# Altium project ife18_TS_BMS_LTC6811_v1.PrjPcb
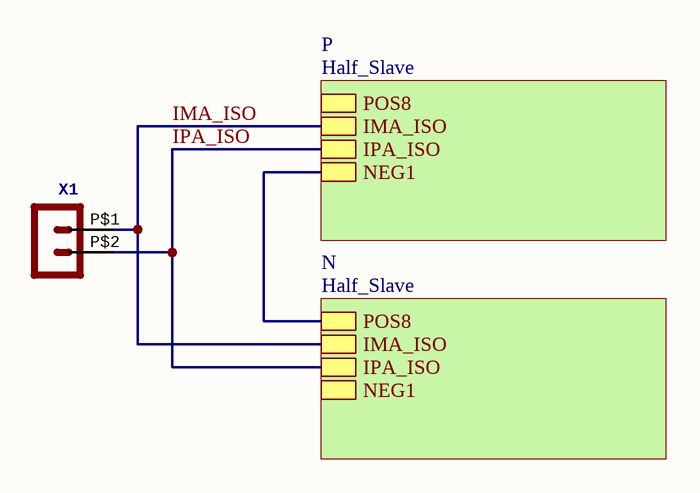
[diagram p0: Slave.SchDoc]
4 sheets, 247 parts. Net scope: hierarchical (ports join the sheet entries above them; power ports are global).
Board file: Slave.PcbDoc
Sheets:
  Slave.SchDoc
    P = Half_Slave.SchDoc
      C = Cells.SchDoc
        1 = Cell.SchDoc
        2 = Cell.SchDoc
        3 = Cell.SchDoc
        4 = Cell.SchDoc
        5 = Cell.SchDoc
        6 = Cell.SchDoc
        7 = Cell.SchDoc
        8 = Cell.SchDoc
    N = Half_Slave.SchDoc
      C = Cells.SchDoc
        1 = Cell.SchDoc
        2 = Cell.SchDoc
        3 = Cell.SchDoc
        4 = Cell.SchDoc
        5 = Cell.SchDoc
        6 = Cell.SchDoc
        7 = Cell.SchDoc
        8 = Cell.SchDoc

## Sheet Slave.SchDoc
size A

### Parts
X1  Molex - Micro-Fit 3.0 Series connector,  3.00mm (0.118") pitch header, 2 positions.  [43650-0224]  (value not drawn)

### Sub-sheets
N = Half_Slave: POS8, IMA_ISO, IPA_ISO, NEG1
P = Half_Slave: POS8, IMA_ISO, IPA_ISO, NEG1

### Nets
IMA_ISO: X1.P$1 ; sheet P/IMA_ISO, sheet N/IMA_ISO
IPA_ISO: X1.P$2 ; sheet P/IPA_ISO, sheet N/IPA_ISO
NEG: sheet P/NEG1, sheet N/POS8

### Library data of the parts
X1 = POS2_MF43650-0224: GateName_1: G$1; SymbolName_1: HEADER_POS2; DeviceSetName: HEADER_POS2_?; DeviceName: 43650-0224; LibraryName: MOLEX Micro-Fit; Package: 43650-0224

## Sheet Half_Slave.SchDoc
size A
Used 2 times, as channels P, N. Parts and nets are listed once, with the designators drawn on the sheet.
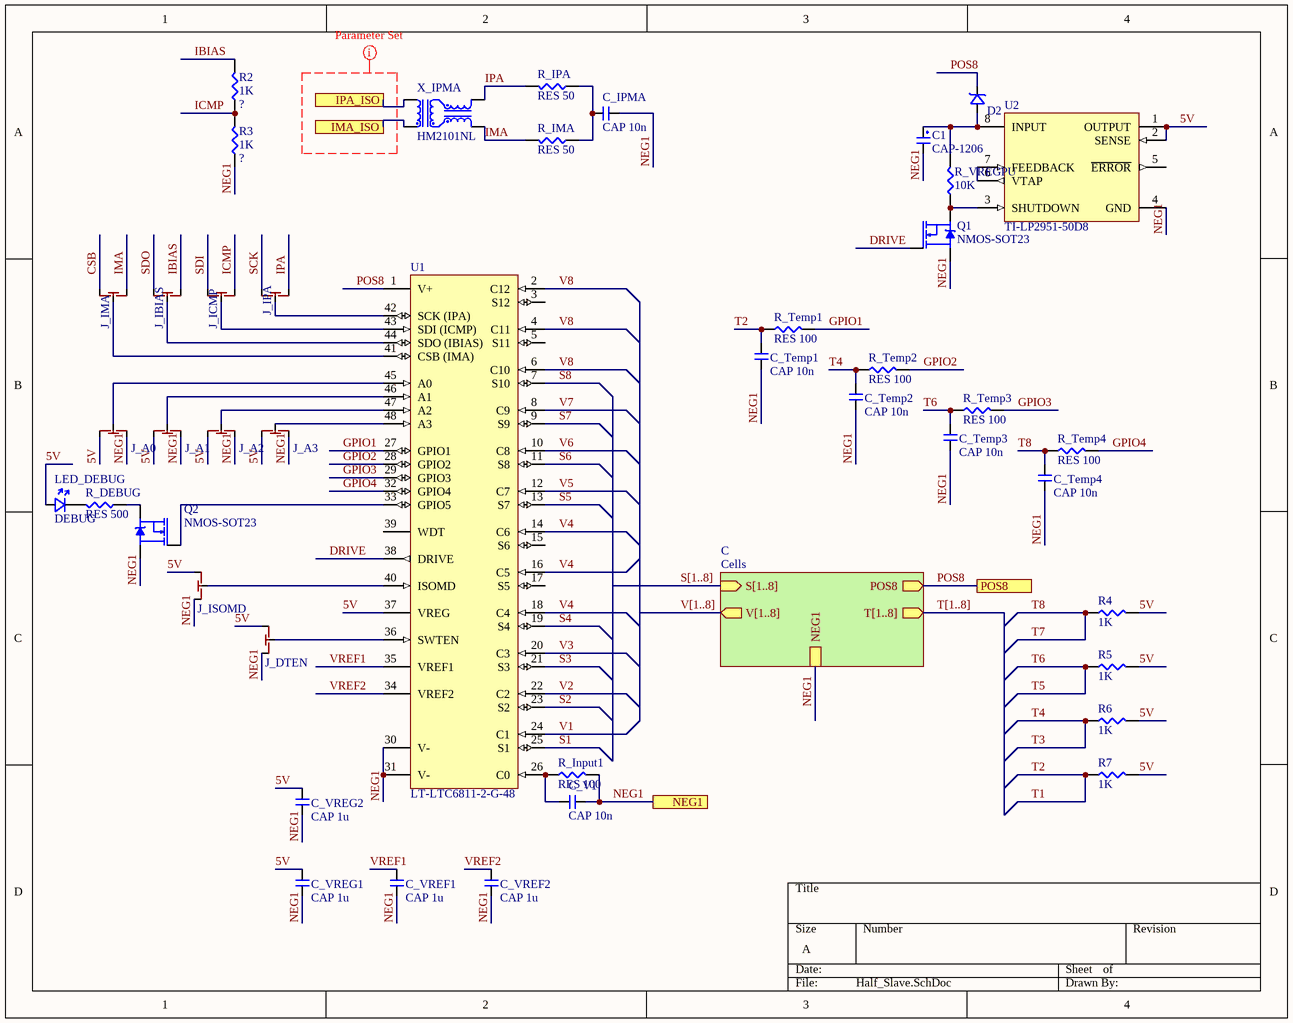
[diagram p1: Half_Slave.SchDoc]

### Parts
C1  CAP-1206  [CAPCP3216X16N]
C_IPMA  CAP 10n  [CAP-0603]
C_Temp1  CAP 10n  [CAP-0603]
C_Temp2  CAP 10n  [CAP-0603]
C_Temp3  CAP 10n  [CAP-0603]
C_Temp4  CAP 10n  [CAP-0603]
C_V1  CAP 10n  [CAP-0603]
C_VREF1  CAP 1u  [CAP-0603]
C_VREF2  CAP 1u  [CAP-0603]
C_VREG1  CAP 1u  [CAP-0603]
C_VREG2  CAP 1u  [CAP-0603]
D2  ?  [SMB]  (value not drawn)
J_A0  DPDT Solder Jumper  [DPDT Solder]  (value not drawn)
J_A1  DPDT Solder Jumper  [DPDT Solder]  (value not drawn)
J_A2  DPDT Solder Jumper  [DPDT Solder]  (value not drawn)
J_A3  DPDT Solder Jumper  [DPDT Solder]  (value not drawn)
J_DTEN  DPDT Solder Jumper  [DPDT Solder]  (value not drawn)
J_IBIAS  DPDT Solder Jumper  [DPDT Solder]  (value not drawn)
J_ICMP  DPDT Solder Jumper  [DPDT Solder]  (value not drawn)
J_IMA  DPDT Solder Jumper  [DPDT Solder]  (value not drawn)
J_IPA  DPDT Solder Jumper  [DPDT Solder]  (value not drawn)
J_ISOMD  DPDT Solder Jumper  [DPDT Solder]  (value not drawn)
LED_DEBUG  DEBUG  [LED-0603]
Q1  NMOS-SOT23  [SOT23]
Q2  NMOS-SOT23  [SOT23]
R2  1K  [RES-0603]
R3  1K  [RES-0603]
R4  1K  [RES-0603]
R5  1K  [RES-0603]
R6  1K  [RES-0603]
R7  1K  [RES-0603]
R_DEBUG  RES 500  [RES-0603]
R_IMA  RES 50  [RES-0603]
R_Input1  RES 100  [RES-0603]
R_IPA  RES 50  [RES-0603]
R_Temp1  RES 100  [RES-0603]
R_Temp2  RES 100  [RES-0603]
R_Temp3  RES 100  [RES-0603]
R_Temp4  RES 100  [RES-0603]
R_VREGPU  10K  [RES-0603]
U1  LT-LTC6811-2-G-48  [SSOP-48N]
U2  TI-LP2951-50D8  [SOIC127P600X175-8N]
X_IPMA  HM2101NL  [HM2101]

### Sub-sheets
C = Cells: S[1..8] (in), POS8 (out), T[1..8] (out), V[1..8] (out), NEG1

### Ports
IMA_ISO, IPA_ISO, NEG1, POS8

### Nets
5V: C_VREG1.2 C_VREG2.2 J_A0.2 J_A1.2 J_A2.2 J_A3.2 J_DTEN.2 J_ISOMD.2 LED_DEBUG.A R4.2 R5.2 R6.2 R7.2 U1.37(VREG) U2.1(OUTPUT) U2.2(SENSE)
CSB: J_IMA.1
DRIVE: Q1.1(G) U1.38(DRIVE)
GPIO1: R_Temp1.2 U1.27(GPIO1)
GPIO2: R_Temp2.2 U1.28(GPIO2)
GPIO3: R_Temp3.2 U1.29(GPIO3)
GPIO4: R_Temp4.2 U1.32(GPIO4)
IBIAS: J_IBIAS.2 R2.2
ICMP: J_ICMP.2 R2.1 R3.2
IMA: J_IMA.2 R_IMA.2 X_IPMA.4
IMA_ISO: X_IPMA.3 ; port IMA_ISO
IPA: J_IPA.2 R_IPA.2 X_IPMA.6
IPA_ISO: X_IPMA.1 ; port IPA_ISO
NEG1: C1.2 C_IPMA.1 C_Temp1.1 C_Temp2.1 C_Temp3.1 C_Temp4.1 C_V1.1 C_VREF1.1 C_VREF2.1 C_VREG1.1 C_VREG2.1 J_A0.1 J_A1.1 J_A2.1 J_A3.1 J_DTEN.1 J_ISOMD.1 Q1.2(S) Q2.2(S) R3.1 R_Input1.2 U1.30(V-) U1.31(V-) U2.4(GND) ; port NEG1, sheet C/NEG1
POS8: D2.K U1.1(V+) ; port POS8, sheet C/POS8
S1: U1.25(S1)
S2: U1.23(S2)
S3: U1.21(S3)
S4: U1.19(S4)
S5: U1.13(S7)
S6: U1.11(S8)
S7: U1.9(S9)
S8: U1.7(S10)
SCK: J_IPA.1
SDI: J_ICMP.1
SDO: J_IBIAS.1
T1: C_Temp1.2 R7.1 R_Temp1.1  [also labelled T2]
T3: C_Temp2.2 R6.1 R_Temp2.1  [also labelled T4]
T5: C_Temp3.2 R5.1 R_Temp3.1  [also labelled T6]
T7: C_Temp4.2 R4.1 R_Temp4.1  [also labelled T8]
V1: U1.24(C1)
V2: U1.22(C2)
V3: U1.20(C3)
V4: U1.14(C6) U1.16(C5) U1.18(C4)
V5: U1.12(C7)
V6: U1.10(C8)
V7: U1.8(C9)
V8: U1.2(C12) U1.4(C11) U1.6(C10)
VREF1: C_VREF1.2 U1.35(VREF1)
VREF2: C_VREF2.2 U1.34(VREF2)
NetC1_1: C1.1 D2.A R_VREGPU.2 U2.8(INPUT)
NetC_IPMA_2: C_IPMA.2 R_IMA.1 R_IPA.1
NetC_V1_2: C_V1.2 R_Input1.1 U1.26(C0)
NetJ_A0_3: J_A0.3 U1.45(A0)
NetJ_A1_3: J_A1.3 U1.46(A1)
NetJ_A2_3: J_A2.3 U1.47(A2)
NetJ_A3_3: J_A3.3 U1.48(A3)
NetJ_DTEN_3: J_DTEN.3 U1.36(SWTEN)
NetJ_IBIAS_3: J_IBIAS.3 U1.44(SDO_(IBIAS))
NetJ_ICMP_3: J_ICMP.3 U1.43(SDI_(ICMP))
NetJ_IMA_3: J_IMA.3 U1.41(CSB_(IMA))
NetJ_IPA_3: J_IPA.3 U1.42(SCK_(IPA))
NetJ_ISOMD_3: J_ISOMD.3 U1.40(ISOMD)
NetLED_DEBUG_K: LED_DEBUG.K R_DEBUG.2
NetQ1_3: Q1.3(D) R_VREGPU.1 U2.3(SHUTDOWN)
NetQ2_1: Q2.1(G) U1.33(GPIO5)
NetQ2_3: Q2.3(D) R_DEBUG.1
NetU2_6: U2.6(VTAP) U2.7(FEEDBACK)

Not connected (* = marked no-connect by the designer): U1 3(S12) 5(S11) 15(S6) 17(S5) 39(WDT); U2 5(~{ERROR})

### Channels
P: designators end in _P; ports IMA_ISO=IMA_ISO IPA_ISO=IPA_ISO NEG1=NEG POS8=POS8_P
N: designators end in _N; ports IMA_ISO=IMA_ISO IPA_ISO=IPA_ISO NEG1=NEG POS8=NEG

### Buses and harness runs
bus S[1..8] = sheet C/S[1..8]
bus T[1..8] = sheet C/T[1..8]
bus V[1..8] = sheet C/V[1..8]

### Layout directives
rule Clearance Constraint [Clearance = 32mil]; net class ISO: (no net found under the mark)

### Library data of the parts
C_IPMA C_Temp1-C_Temp4 C_V1 C_VREF1 C_VREF2 C_VREG1 C_VREG2 = CAP-0603
D2 = DIODE-SMB
J_A0-J_A3 J_DTEN J_IBIAS J_ICMP J_IMA J_IPA J_ISOMD = DPDT Solder
LED_DEBUG = LED-0603
R2 R3 = RES_0603: RES SMD 0603; Company: IFE; Part: RES_0603; Value: ?; Package: 0603
R4-R7 R_DEBUG R_IMA R_Input1 R_IPA R_Temp1-R_Temp4 R_VREGPU = RES-0603

## Sheet Cells.SchDoc
size 190 x 114 mm
Used 2 times, as channels P/C, N/C. Parts and nets are listed once, with the designators drawn on the sheet.
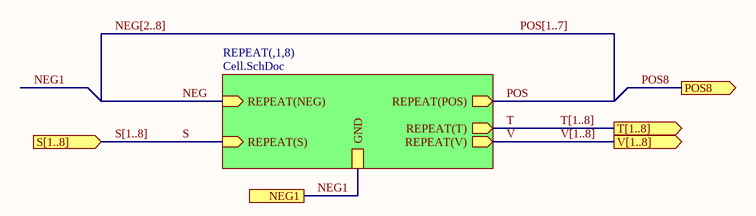
[diagram p2: Cells.SchDoc]

### Sub-sheets
REPEAT(,1,8) = Cell.SchDoc: REPEAT(NEG) (in), REPEAT(POS) (out), REPEAT(T) (out), REPEAT(V) (out), REPEAT(S) (in), GND

### Ports
NEG1, POS8 (out), S[1..8] (in), T[1..8] (out), V[1..8] (out)

### Nets
NEG: sheet REPEAT(,1,8)/REPEAT(NEG)
NEG1: port NEG1, sheet REPEAT(,1,8)/GND
POS: sheet REPEAT(,1,8)/REPEAT(POS)
POS8: port POS8
S: sheet REPEAT(,1,8)/REPEAT(S)
T: sheet REPEAT(,1,8)/REPEAT(T)
V: sheet REPEAT(,1,8)/REPEAT(V)

### Channels
P/C: ports NEG1=NEG POS8=POS8_P
N/C: ports NEG1=NEG POS8=NEG

### Buses and harness runs
bus NEG[2..8] = POS[1..7]
bus S[1..8] = port S[1..8]
bus T[1..8] = port T[1..8]
bus V[1..8] = port V[1..8]

## Sheet Cell.SchDoc
size 152 x 88 mm
Used 16 times, as channels P/C/1, P/C/2, P/C/3, P/C/4, P/C/5, P/C/6, P/C/7, P/C/8, N/C/1, N/C/2, N/C/3, N/C/4, N/C/5, N/C/6, N/C/7, N/C/8. Parts and nets are listed once, with the designators drawn on the sheet.
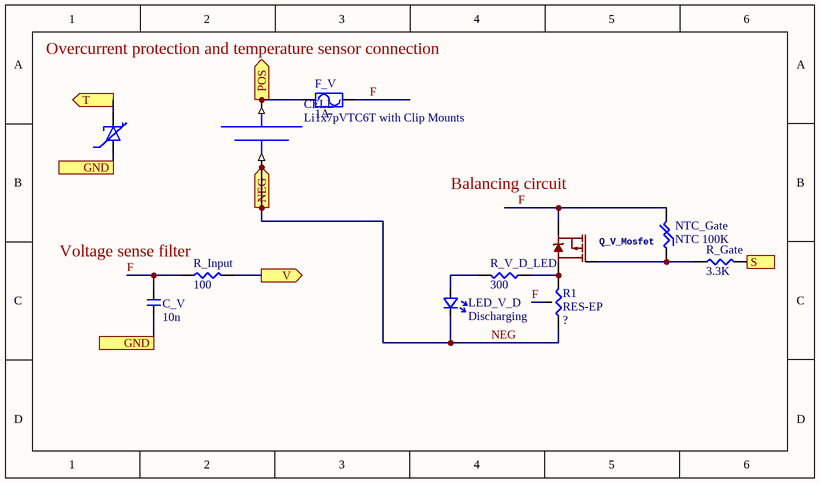
[diagram p3: Cell.SchDoc]

### Parts
C_V  10n  [CAP-0603]
CELL  Li1x7pVTC6T with Clip Mounts  [Li1x7pVTC6T_Clips]
F_V  1A  [2410SMD]
LED_V_D  Discharging  [LED-0603]
NTC_Gate  NTC 100K  [NTC-0603]
Q_V_Mosfet  (no value)  [TO252]
R1  RES-EP  [RES-TO252]
R_Gate  3.3K  [RES-0603]
R_Input  100  [RES-0603]
R_V_D_LED  300  [RES-0603]

### Ports
GND, NEG (in), POS (out), S (in), T (out), V (out)

### Nets
F: C_V.2 F_V.1 NTC_Gate.2 Q_V_Mosfet.3(S) R1.3 R_Input.1
GND: C_V.1 CELL.T- ; port GND
NEG: CELL.- CELL.-L CELL.-O CELL.-R LED_V_D.K R1.1 ; port NEG
POS: CELL.+ CELL.+L CELL.+O CELL.+R F_V.2 ; port POS
S: R_Gate.2 ; port S
T: CELL.T+ ; port T
V: R_Input.2 ; port V
NetLED_V_D_A: LED_V_D.A R_V_D_LED.2
NetNTC_Gate_1: NTC_Gate.1 Q_V_Mosfet.1(G) R_Gate.1
NetQ_V_Mosfet_2: Q_V_Mosfet.2(D) R1.2 R_V_D_LED.1

### Channels
P/C/1: designators end in _CELL9; ports GND=NEG NEG=NEG POS=NEG S=S1_P T=T1_P V=V1_P
P/C/2: designators end in _CELL10; ports GND=NEG NEG=NEG POS=NEG S=S2_P T=T1_P V=V2_P
P/C/3: designators end in _CELL11; ports GND=NEG NEG=NEG POS=NEG S=S3_P T=T3_P V=V3_P
P/C/4: designators end in _CELL12; ports GND=NEG NEG=NEG POS=NEG S=S4_P T=T3_P V=V4_P
P/C/5: designators end in _CELL13; ports GND=NEG NEG=NEG POS=NEG S=S5_P T=T5_P V=V5_P
P/C/6: designators end in _CELL14; ports GND=NEG NEG=NEG POS=NEG S=S6_P T=T5_P V=V6_P
P/C/7: designators end in _CELL15; ports GND=NEG NEG=NEG POS=NEG S=S7_P T=T7_P V=V7_P
P/C/8: designators end in _CELL16; ports GND=NEG NEG=NEG POS=POS8_P S=S8_P T=T7_P V=V8_P
N/C/1: designators end in _CELL1; ports GND=NEG NEG=NEG POS=NEG S=S1_N T=T1_N V=V1_N
N/C/2: designators end in _CELL2; ports GND=NEG NEG=NEG POS=NEG S=S2_N T=T1_N V=V2_N
N/C/3: designators end in _CELL3; ports GND=NEG NEG=NEG POS=NEG S=S3_N T=T3_N V=V3_N
N/C/4: designators end in _CELL4; ports GND=NEG NEG=NEG POS=NEG S=S4_N T=T3_N V=V4_N
N/C/5: designators end in _CELL5; ports GND=NEG NEG=NEG POS=NEG S=S5_N T=T5_N V=V5_N
N/C/6: designators end in _CELL6; ports GND=NEG NEG=NEG POS=NEG S=S6_N T=T5_N V=V6_N
N/C/7: designators end in _CELL7; ports GND=NEG NEG=NEG POS=NEG S=S7_N T=T7_N V=V7_N
N/C/8: designators end in _CELL8; ports GND=NEG NEG=NEG POS=NEG S=S8_N T=T7_N V=V8_N

### Notes on the sheet
- Overcurrent protection and temperature sensor connection
- (near Q_V_Mosfet) Balancing circuit
- (near R_Input) Voltage sense filter

### Library data of the parts
C_V = CAP-0603
CELL = Li1x7pVTC6T_Clip
F_V = 0679L
LED_V_D = LED-0603
NTC_Gate = NTC-0603
Q_V_Mosfet = DMP10H400SK3-13: GateName_1: G$1; SymbolName_1: LABELED-PMOS; LibraryName: IFE_Transistors; DeviceSetName: DMP10H400SK3-13; Package: TO252
R1 = RES_TO252: RES SMD TO252; Company: IFE; Part: RES_TO252; Value: ?; Package: TO252
R_Gate R_Input R_V_D_LED = RES-0603

## Nets that join several sheets
IMA_ISO: Slave (X1.P$1), P (X_IPMA_P.3), N (X_IPMA_N.3)
IPA_ISO: Slave (X1.P$2), P (X_IPMA_P.1), N (X_IPMA_N.1)
NEG: P (24 pins), P/C/1 (8 pins), P/C/2 (C_V_CELL10.1 CELL_CELL10.T-), P/C/3 (C_V_CELL11.1 CELL_CELL11.T-), P/C/4 (C_V_CELL12.1 CELL_CELL12.T-), P/C/5 (C_V_CELL13.1 CELL_CELL13.T-), P/C/6 (C_V_CELL14.1 CELL_CELL14.T-), P/C/7 (C_V_CELL15.1 CELL_CELL15.T-), P/C/8 (C_V_CELL16.1 CELL_CELL16.T-), N (D2_N.K U1_N.1), N/C/8 (5 pins)
NEG: P/C/1 (5 pins), P/C/2 (6 pins)
NEG: P/C/2 (5 pins), P/C/3 (6 pins)
NEG: P/C/3 (5 pins), P/C/4 (6 pins)
NEG: P/C/4 (5 pins), P/C/5 (6 pins)
NEG: P/C/5 (5 pins), P/C/6 (6 pins)
NEG: P/C/6 (5 pins), P/C/7 (6 pins)
NEG: P/C/7 (5 pins), P/C/8 (6 pins)
NEG: N (24 pins), N/C/1 (8 pins), N/C/2 (C_V_CELL2.1 CELL_CELL2.T-), N/C/3 (C_V_CELL3.1 CELL_CELL3.T-), N/C/4 (C_V_CELL4.1 CELL_CELL4.T-), N/C/5 (C_V_CELL5.1 CELL_CELL5.T-), N/C/6 (C_V_CELL6.1 CELL_CELL6.T-), N/C/7 (C_V_CELL7.1 CELL_CELL7.T-), N/C/8 (C_V_CELL8.1 CELL_CELL8.T-)
NEG: N/C/1 (5 pins), N/C/2 (6 pins)
NEG: N/C/2 (5 pins), N/C/3 (6 pins)
NEG: N/C/3 (5 pins), N/C/4 (6 pins)
NEG: N/C/4 (5 pins), N/C/5 (6 pins)
NEG: N/C/5 (5 pins), N/C/6 (6 pins)
NEG: N/C/6 (5 pins), N/C/7 (6 pins)
NEG: N/C/7 (5 pins), N/C/8 (6 pins)
POS8_P: P (D2_P.K U1_P.1), P/C/8 (5 pins)
S1_N: N (U1_N.25), N/C/1 (R_Gate_CELL1.2)
S1_P: P (U1_P.25), P/C/1 (R_Gate_CELL9.2)
S2_N: N (U1_N.23), N/C/2 (R_Gate_CELL2.2)
S2_P: P (U1_P.23), P/C/2 (R_Gate_CELL10.2)
S3_N: N (U1_N.21), N/C/3 (R_Gate_CELL3.2)
S3_P: P (U1_P.21), P/C/3 (R_Gate_CELL11.2)
S4_N: N (U1_N.19), N/C/4 (R_Gate_CELL4.2)
S4_P: P (U1_P.19), P/C/4 (R_Gate_CELL12.2)
S5_N: N (U1_N.13), N/C/5 (R_Gate_CELL5.2)
S5_P: P (U1_P.13), P/C/5 (R_Gate_CELL13.2)
S6_N: N (U1_N.11), N/C/6 (R_Gate_CELL6.2)
S6_P: P (U1_P.11), P/C/6 (R_Gate_CELL14.2)
S7_N: N (U1_N.9), N/C/7 (R_Gate_CELL7.2)
S7_P: P (U1_P.9), P/C/7 (R_Gate_CELL15.2)
S8_N: N (U1_N.7), N/C/8 (R_Gate_CELL8.2)
S8_P: P (U1_P.7), P/C/8 (R_Gate_CELL16.2)
T1_N: N (C_Temp1_N.2 R7_N.1 R_Temp1_N.1), N/C/1 (CELL_CELL1.T+), N/C/2 (CELL_CELL2.T+)
T1_P: P (C_Temp1_P.2 R7_P.1 R_Temp1_P.1), P/C/1 (CELL_CELL9.T+), P/C/2 (CELL_CELL10.T+)
T3_N: N (C_Temp2_N.2 R6_N.1 R_Temp2_N.1), N/C/3 (CELL_CELL3.T+), N/C/4 (CELL_CELL4.T+)
T3_P: P (C_Temp2_P.2 R6_P.1 R_Temp2_P.1), P/C/3 (CELL_CELL11.T+), P/C/4 (CELL_CELL12.T+)
T5_N: N (C_Temp3_N.2 R5_N.1 R_Temp3_N.1), N/C/5 (CELL_CELL5.T+), N/C/6 (CELL_CELL6.T+)
T5_P: P (C_Temp3_P.2 R5_P.1 R_Temp3_P.1), P/C/5 (CELL_CELL13.T+), P/C/6 (CELL_CELL14.T+)
T7_N: N (C_Temp4_N.2 R4_N.1 R_Temp4_N.1), N/C/7 (CELL_CELL7.T+), N/C/8 (CELL_CELL8.T+)
T7_P: P (C_Temp4_P.2 R4_P.1 R_Temp4_P.1), P/C/7 (CELL_CELL15.T+), P/C/8 (CELL_CELL16.T+)
V1_N: N (U1_N.24), N/C/1 (R_Input_CELL1.2)
V1_P: P (U1_P.24), P/C/1 (R_Input_CELL9.2)
V2_N: N (U1_N.22), N/C/2 (R_Input_CELL2.2)
V2_P: P (U1_P.22), P/C/2 (R_Input_CELL10.2)
V3_N: N (U1_N.20), N/C/3 (R_Input_CELL3.2)
V3_P: P (U1_P.20), P/C/3 (R_Input_CELL11.2)
V4_N: N (U1_N.14 U1_N.16 U1_N.18), N/C/4 (R_Input_CELL4.2)
V4_P: P (U1_P.14 U1_P.16 U1_P.18), P/C/4 (R_Input_CELL12.2)
V5_N: N (U1_N.12), N/C/5 (R_Input_CELL5.2)
V5_P: P (U1_P.12), P/C/5 (R_Input_CELL13.2)
V6_N: N (U1_N.10), N/C/6 (R_Input_CELL6.2)
V6_P: P (U1_P.10), P/C/6 (R_Input_CELL14.2)
V7_N: N (U1_N.8), N/C/7 (R_Input_CELL7.2)
V7_P: P (U1_P.8), P/C/7 (R_Input_CELL15.2)
V8_N: N (U1_N.2 U1_N.4 U1_N.6), N/C/8 (R_Input_CELL8.2)
V8_P: P (U1_P.2 U1_P.4 U1_P.6), P/C/8 (R_Input_CELL16.2)